# EAGLE design gaggia (EAGLE 6.5.0)
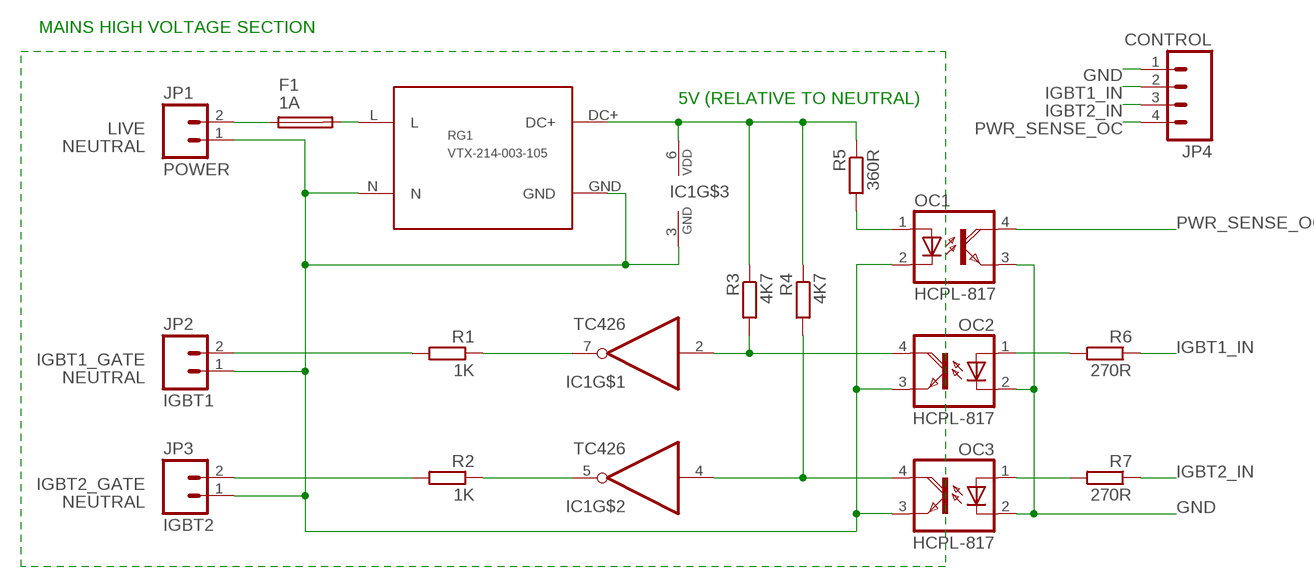
[diagram p0: schematic, sheet 1]

## Parts
F1  1A  FUSETE5  [TE5]
IC1  TC426  [DIL08]
JP1  POWER  M025MM  [SCREWTERMINAL-5MM-2]
JP2  IGBT1  M02PTH  [1X02]
JP3  IGBT2  M02PTH  [1X02]
JP4  CONTROL  M04PTH  [1X04]
OC1  HCPL-817  TIL197  [DIL04]
OC2  HCPL-817  TIL197  [DIL04]
OC3  HCPL-817  TIL197  [DIL04]
R1  1K  R-EU_0204/7  [0204/7]
R2  1K  R-EU_0204/7  [0204/7]
R3  4K7  R-EU_0204/7  [0204/7]
R4  4K7  R-EU_0204/7  [0204/7]
R5  360R  R-EU_0204/7  [0204/7]
R6  270R  R-EU_0204/7  [0204/7]
R7  270R  R-EU_0204/7  [0204/7]
RG1  VTX-214-003-105  [VTX-214-003]

## Nets
5V_NON_ISOLATED: IC1.6(VDD) R3.1 R4.1 R5.1 RG1.DC+
GND: JP4.1 OC1.3(EMI) OC2.2(C) OC3.2(C)
IGBT1_GATE: JP2.2 R1.2
IGBT1_IN: JP4.2 R6.1
IGBT2_GATE: JP3.2 R2.2
IGBT2_IN: JP4.3 R7.1
LIVE: F1.1 JP1.2
N$2: IC1.4(I) OC3.4(COL) R4.2
N$3: IC1.5(O) R2.1
N$4: OC3.1(A) R7.2
N$9: IC1.7(O) R1.1
N$25: OC1.1(A) R5.2
N$35: OC2.1(A) R6.2
N$38: IC1.2(I) OC2.4(COL) R3.2
N$39: F1.2 RG1.L
NEUTRAL: IC1.3(GND) JP1.1 JP2.1 JP3.1 OC1.2(C) OC2.3(EMI) OC3.3(EMI) RG1.GND RG1.N
PWR_SENSE_OC: JP4.4 OC1.4(COL)

## Notes on the sheet
- MAINS HIGH VOLTAGE SECTION
- 5V (RELATIVE TO NEUTRAL)

## Library data of the parts
F1 = fuse:FUSE: Fuse; OC_FARNELL: unknown; OC_NEWARK: unknown
IC1 = james:TC426: 1.5A Dual High-Speed Power MOSFET Driver
JP1-JP3 = SparkFun-Connectors:M02: Standard 2-pin 0.1" header. Use with - straight break away headers ( PRT-00116) - right angle break away headers (PRT-00553) - swiss pins (PRT-00743) - machine pins (PRT-00117) - female headers (PRT-00115) Molex polarized connector foot print use with: PRT-08233 with associated crimp pins and housings. 2.54_SCREWTERM for use with PRT-10571. 3.5mm Screw Terminal footprints for PRT-08084 5mm Screw Terminal footprints for use with PRT-08433
JP4 = SparkFun-Connectors:M04: Header 4 Standard 4-pin 0.1" header. Use with straight break away headers (SKU : PRT-00116), right angle break away headers (PRT-00553), swiss pins (PRT-00743), machine pins (PRT-00117), and female headers (PRT-00115). Molex polarized connector foot print use with SKU : PRT-08231 with associated crimp pins and housings. 1MM SMD Version SKU: PRT-10208
OC1-OC3 = optocoupler:TIL197: TEXAS INSTRUMENTS OPTO COUPLER; OC_FARNELL: 1683368; OC_NEWARK: unknown
R1-R7 = resistor:R-EU_: RESISTOR, European symbol
RG1 = james:VTX-214-003-105

## Board
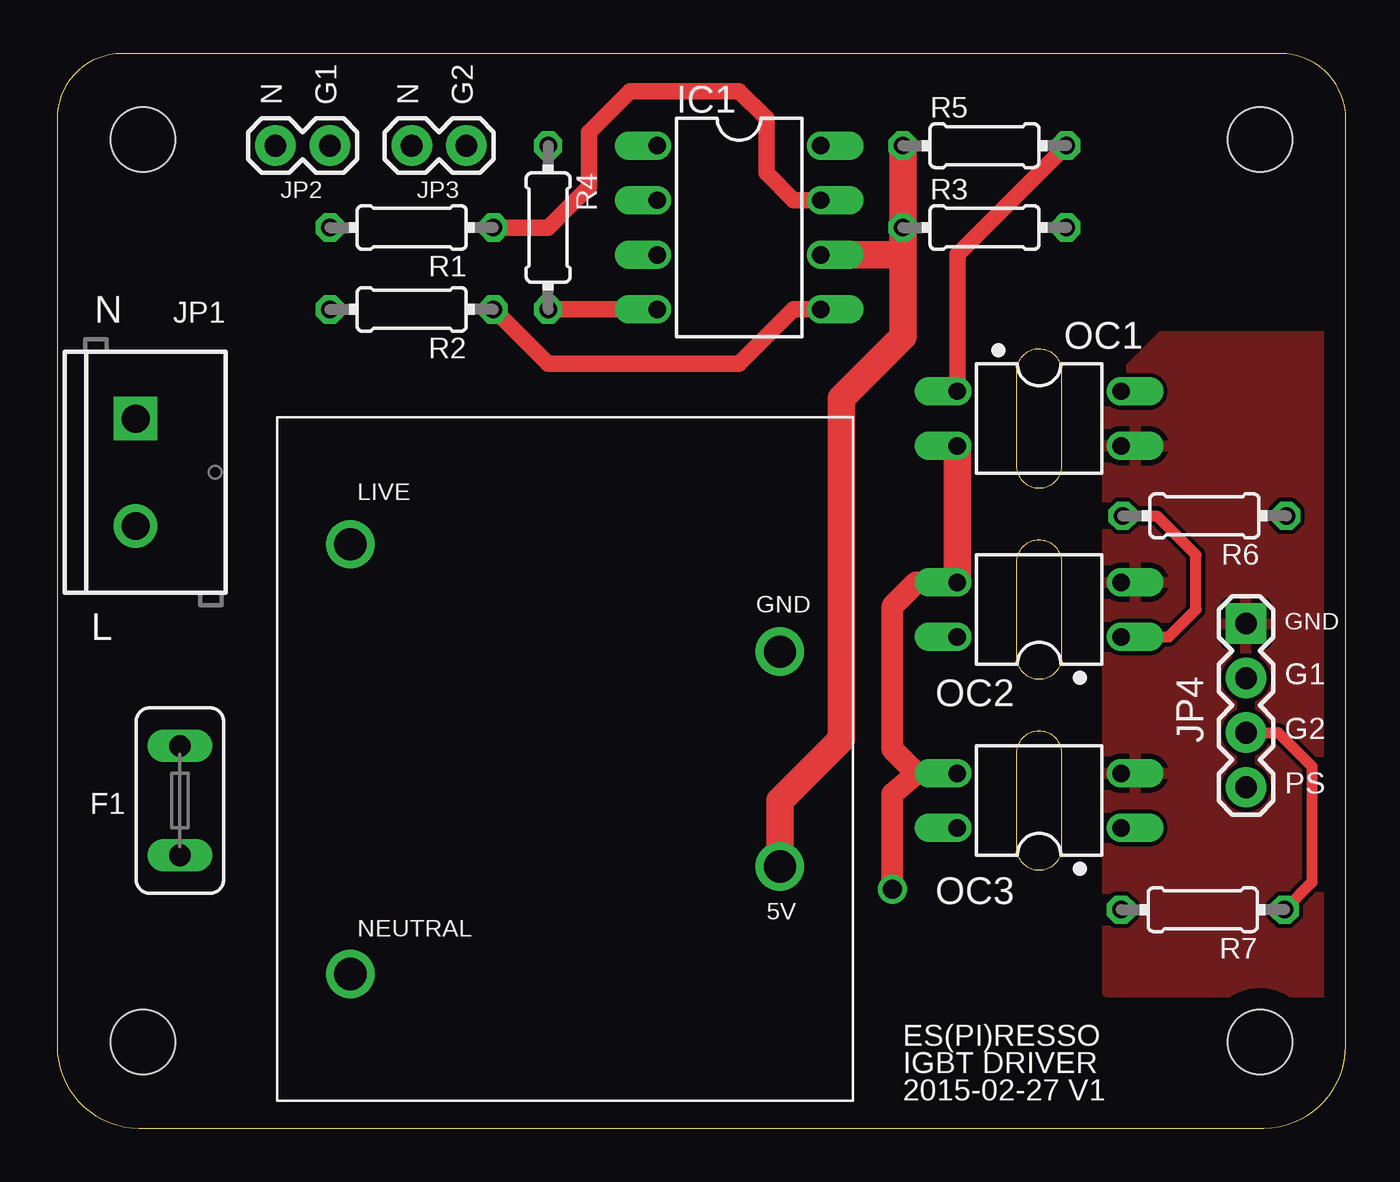
[diagram p1: board, top side]
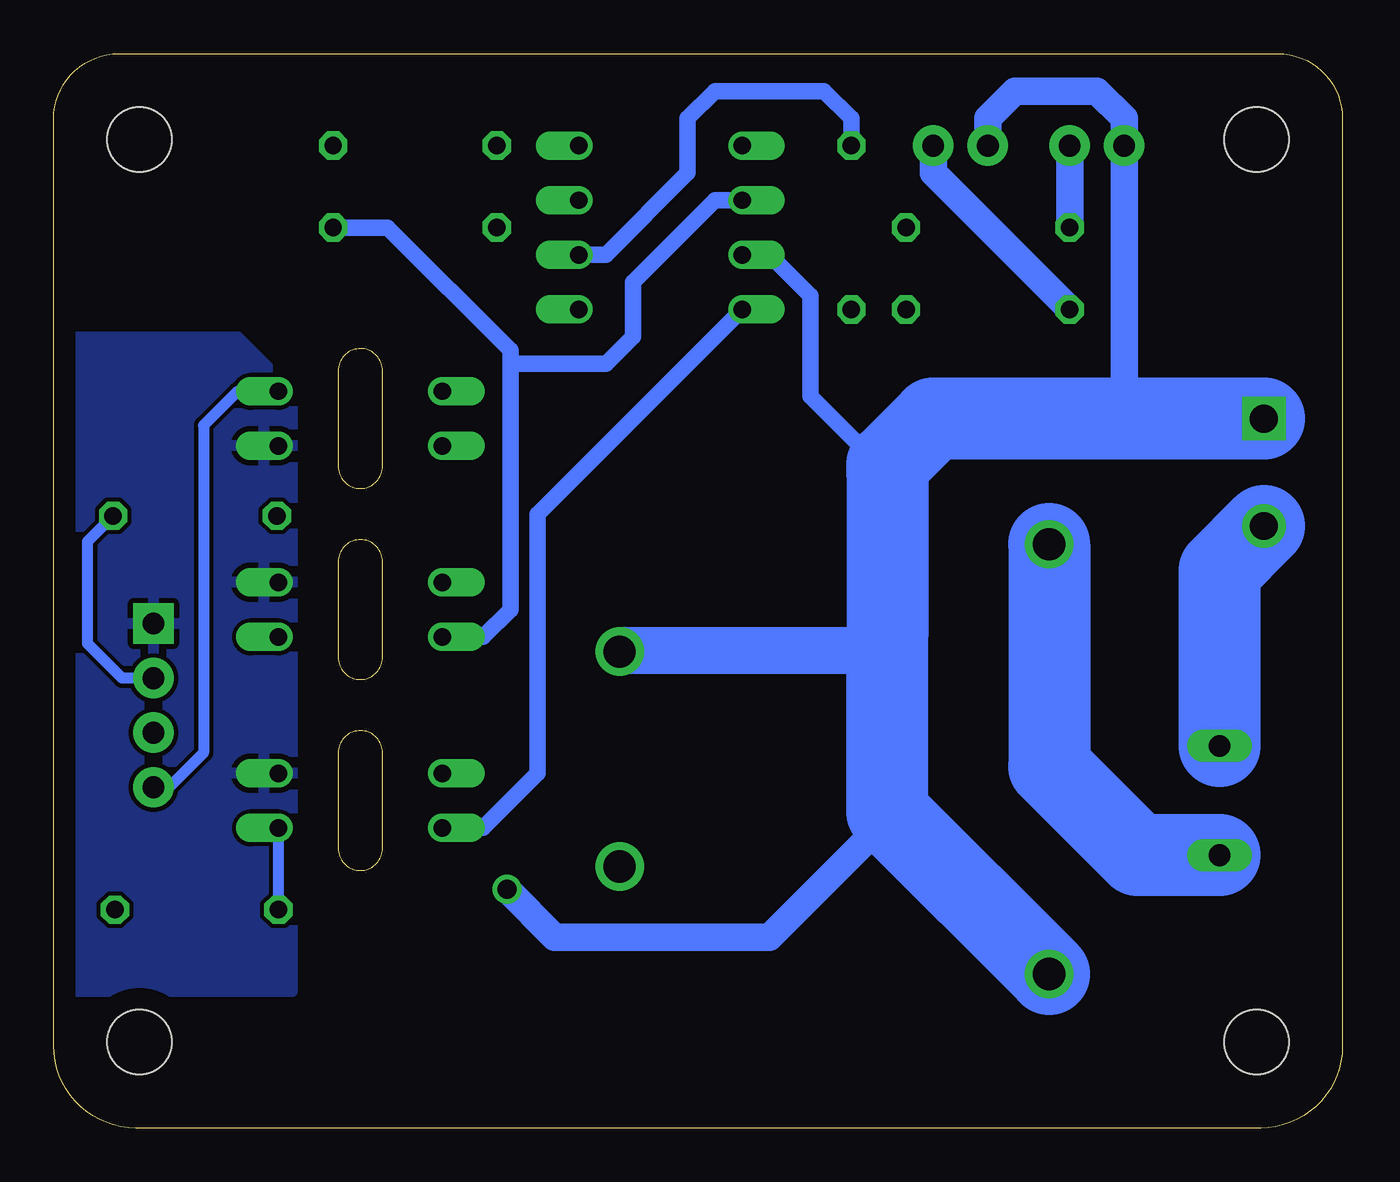
[diagram p2: board, bottom side, seen from below]

Size 60 x 50 mm. Coordinates in mm from the lower left corner, seen from the top.
Outline: 0,46.99 0,3.81 arc90 3.81,0 56.18,0 arc90 60,3.82 60,46.97 arc90 56.97,50 3.01,50 arc90 0,46.99
Outline: 46.75,35.24 46.75,30.79 arc-90 45.72,29.77 arc-90 44.69,30.8 44.69,35.25 arc-90 45.72,36.27 arc-90 46.75,35.24
Outline: 46.75,26.35 46.75,21.9 arc-90 45.72,20.88 arc-90 44.69,21.91 44.69,26.36 arc-90 45.72,27.38 arc-90 46.75,26.35
Outline: 46.75,17.46 46.75,13.01 arc-90 45.72,11.99 arc-90 44.69,13.02 44.69,17.47 arc-90 45.72,18.49 arc-90 46.75,17.46
Copper layers (1*16): Top 0.035mm / dielectric 1.5mm / Bottom 0.035mm
Design rules "default": minimum track width 10mil, minimum drill 24mil, track to track 8mil, track to pad 8mil, pad to pad 8mil, via to via 8mil, smd to smd 8mil, copper to edge 40mil, drill to drill 8mil, minimum pad ring 10mil, minimum via ring 8mil, stop-mask expansion 4mil, vias tented up to drill 0mil, thermal gap 10mil
Holes 3 mm at 4,46 4,4 56,46 56,4

### Footprints (pad centres in the part's own frame; a part is rotated, then mirrored left to right if it is on the bottom)
TE5 = drill 1.016 long: 1 -2.54,0; 2 2.54,0
DIL08 = drill 0.813 offset: 1 -3.81,-3.81; 2 -1.27,-3.81; 3 1.27,-3.81; 4 3.81,-3.81; 5 3.81,3.81; 6 1.27,3.81; 7 -1.27,3.81; 8 -3.81,3.81
SCREWTERMINAL-5MM-2 = drill 1.3 pad 2.032 square: 1 0,0 | drill 1.3 pad 2.032: 2 5,0
1X02 = drill 1.016 pad 1.88: 1 0,0; 2 2.54,0
1X04 = drill 1.016 pad 1.88 square: 1 0,0 | drill 1.016 pad 1.88: 2 2.54,0; 3 5.08,0; 4 7.62,0
DIL04 = drill 0.813 offset: 1 -1.27,-3.81; 2 1.27,-3.81; 3 1.27,3.81; 4 -1.27,3.81
0204/7 = drill 0.813 octagon: 1 -3.81,0; 2 3.81,0
VTX-214-003 = drill 1.5: DC+ -5,-10; GND 5,-10; L 10,10; N -10,10

### Placement (x,y rotation side)
F1  5.71,15.24 270 top
IC1  31.75,41.91 270 top
JP1  3.65,33.02 270 top
JP2  10.16,45.72 0 top
JP3  16.51,45.72 0 top
JP4  55.35,23.48 270 top
OC1  45.72,33.02 270 top
OC2  45.72,24.13 90 top
OC3  45.72,15.24 90 top
R1  16.51,41.91 180 top
R2  16.51,38.1 180 top
R3  43.18,41.91 0 top
R4  22.86,41.91 270 top
R5  43.18,45.72 0 top
R6  53.42,28.5 180 top
R7  53.34,10.16 180 top
RG1  23.65,17.17 90 top

### Tracks (layer width: path | path; a pad name or v marks a point on that pad's centre or on a via)
5V_NON_ISOLATED
  Top 1.27: IC1.6 39.37,40.64 R3.1 | R3.1 R5.1 | R3.1 39.37,36.83 36.51,33.97 36.51,18.1 33.65,15.23 RG1.DC+
  Bottom 0.762: R4.1 22.86,46.99 24.13,48.26 29.21,48.26 30.48,46.99 30.48,44.45 34.29,40.64 IC1.6
GND
  pour Bottom: 59.69,36.83 51.44,36.83 48.9,34.29 48.9,6.35 59.69,6.35
  pour Top: 59.69,36.83 51.44,36.83 48.9,34.29 48.9,6.35 59.69,6.35
IGBT1_GATE
  Bottom 1.27: JP2.2 R1.2
IGBT1_IN
  Bottom 0.508: JP4.2 56.82,20.94 58.42,22.54 58.42,27.3 R6.1
IGBT2_GATE
  Bottom 1.27: JP3.2 19.05,44.45 R2.2
IGBT2_IN
  Top 0.508: JP4.3 56.85,18.4 58.42,16.83 58.42,11.43 R7.1
LIVE
  Bottom 1.016: 5.71,25.88 5.71,25.96
  Bottom 3.81: F1.1 5.71,25.88 | 5.71,25.96 JP1.2
N$2
  Top 0.762: R4.2 IC1.4
  Bottom 0.762: IC1.4 37.47,28.57 37.47,16.51 40.01,13.97 OC3.4
N$3
  Top 0.762: R2.1 22.86,35.56 31.75,35.56 34.29,38.1 IC1.5
N$4
  Bottom 0.508: R7.2 OC3.1
N$9
  Top 0.762: R1.1 22.86,41.91 24.77,43.81 24.77,46.35 26.67,48.26 31.75,48.26 33.02,46.99 33.02,44.45 34.29,43.18 IC1.7
N$25
  Top 0.762: R5.2 41.91,40.64 OC1.1
N$35
  Top 0.508: OC2.1 51.75,22.86 53.02,24.13 53.02,26.67 51.2,28.5 R6.2
N$38
  Bottom 0.762: IC1.2 29.21,43.18 33.02,39.37 33.02,36.83 34.29,35.56 38.73,35.56 | R3.2 44.45,41.91 38.73,36.2 38.73,35.56 | OC2.4 40.01,22.86 38.73,24.13 38.73,35.56
N$39
  Bottom 3.81: F1.2 9.53,12.7 13.65,16.82 RG1.L
NEUTRAL  (via drill 0.9)
  Top 0.762: 40.01,16.51 OC3.3
  Top 1.016: OC2.3 40.01,25.4 38.89,24.29 38.89,17.62 40.01,16.51 38.89,15.56 v38.89,11.11
  Top 1.27: OC2.3 OC1.2
  Bottom 0.508: 21.83,22.23 21.19,22.86
  Bottom 0.762: IC1.3 26.67,40.64 24.77,38.73 24.77,34.05 21.19,30.48 | RG1.GND 33.59,22.23 | 21.83,22.23 21.84,22.23
  Bottom 1.27: 10.16,33.02 JP2.1 10.16,46.99 11.43,48.26 15.24,48.26 16.51,46.99 JP3.1 | v38.89,11.11 36.67,8.89 26.67,8.89 21.02,14.54
  Bottom 2.184: 33.59,22.23 21.84,22.23
  Bottom 3.81: JP1.1 10.16,33.02 19.05,33.02 21.19,30.88 21.19,30.48 21.19,22.86 21.19,14.71 21.02,14.54 RG1.N
PWR_SENSE_OC
  Bottom 0.508: OC1.4 51.44,34.29 53.02,32.7 53.02,17.46 54.61,15.88 55.34,15.88 JP4.4

### Text on the board
tNames: N | G1 | N | G2 | N | LIVE | GND | L | GND | G1 | G2 | PS | 5V | NEUTRAL | ES(PI)RESSO | IGBT DRIVER | 2015-02-27 V1